# EAGLE design Sensor Acquisition Board Front rev1 (EAGLE 9.6.2)
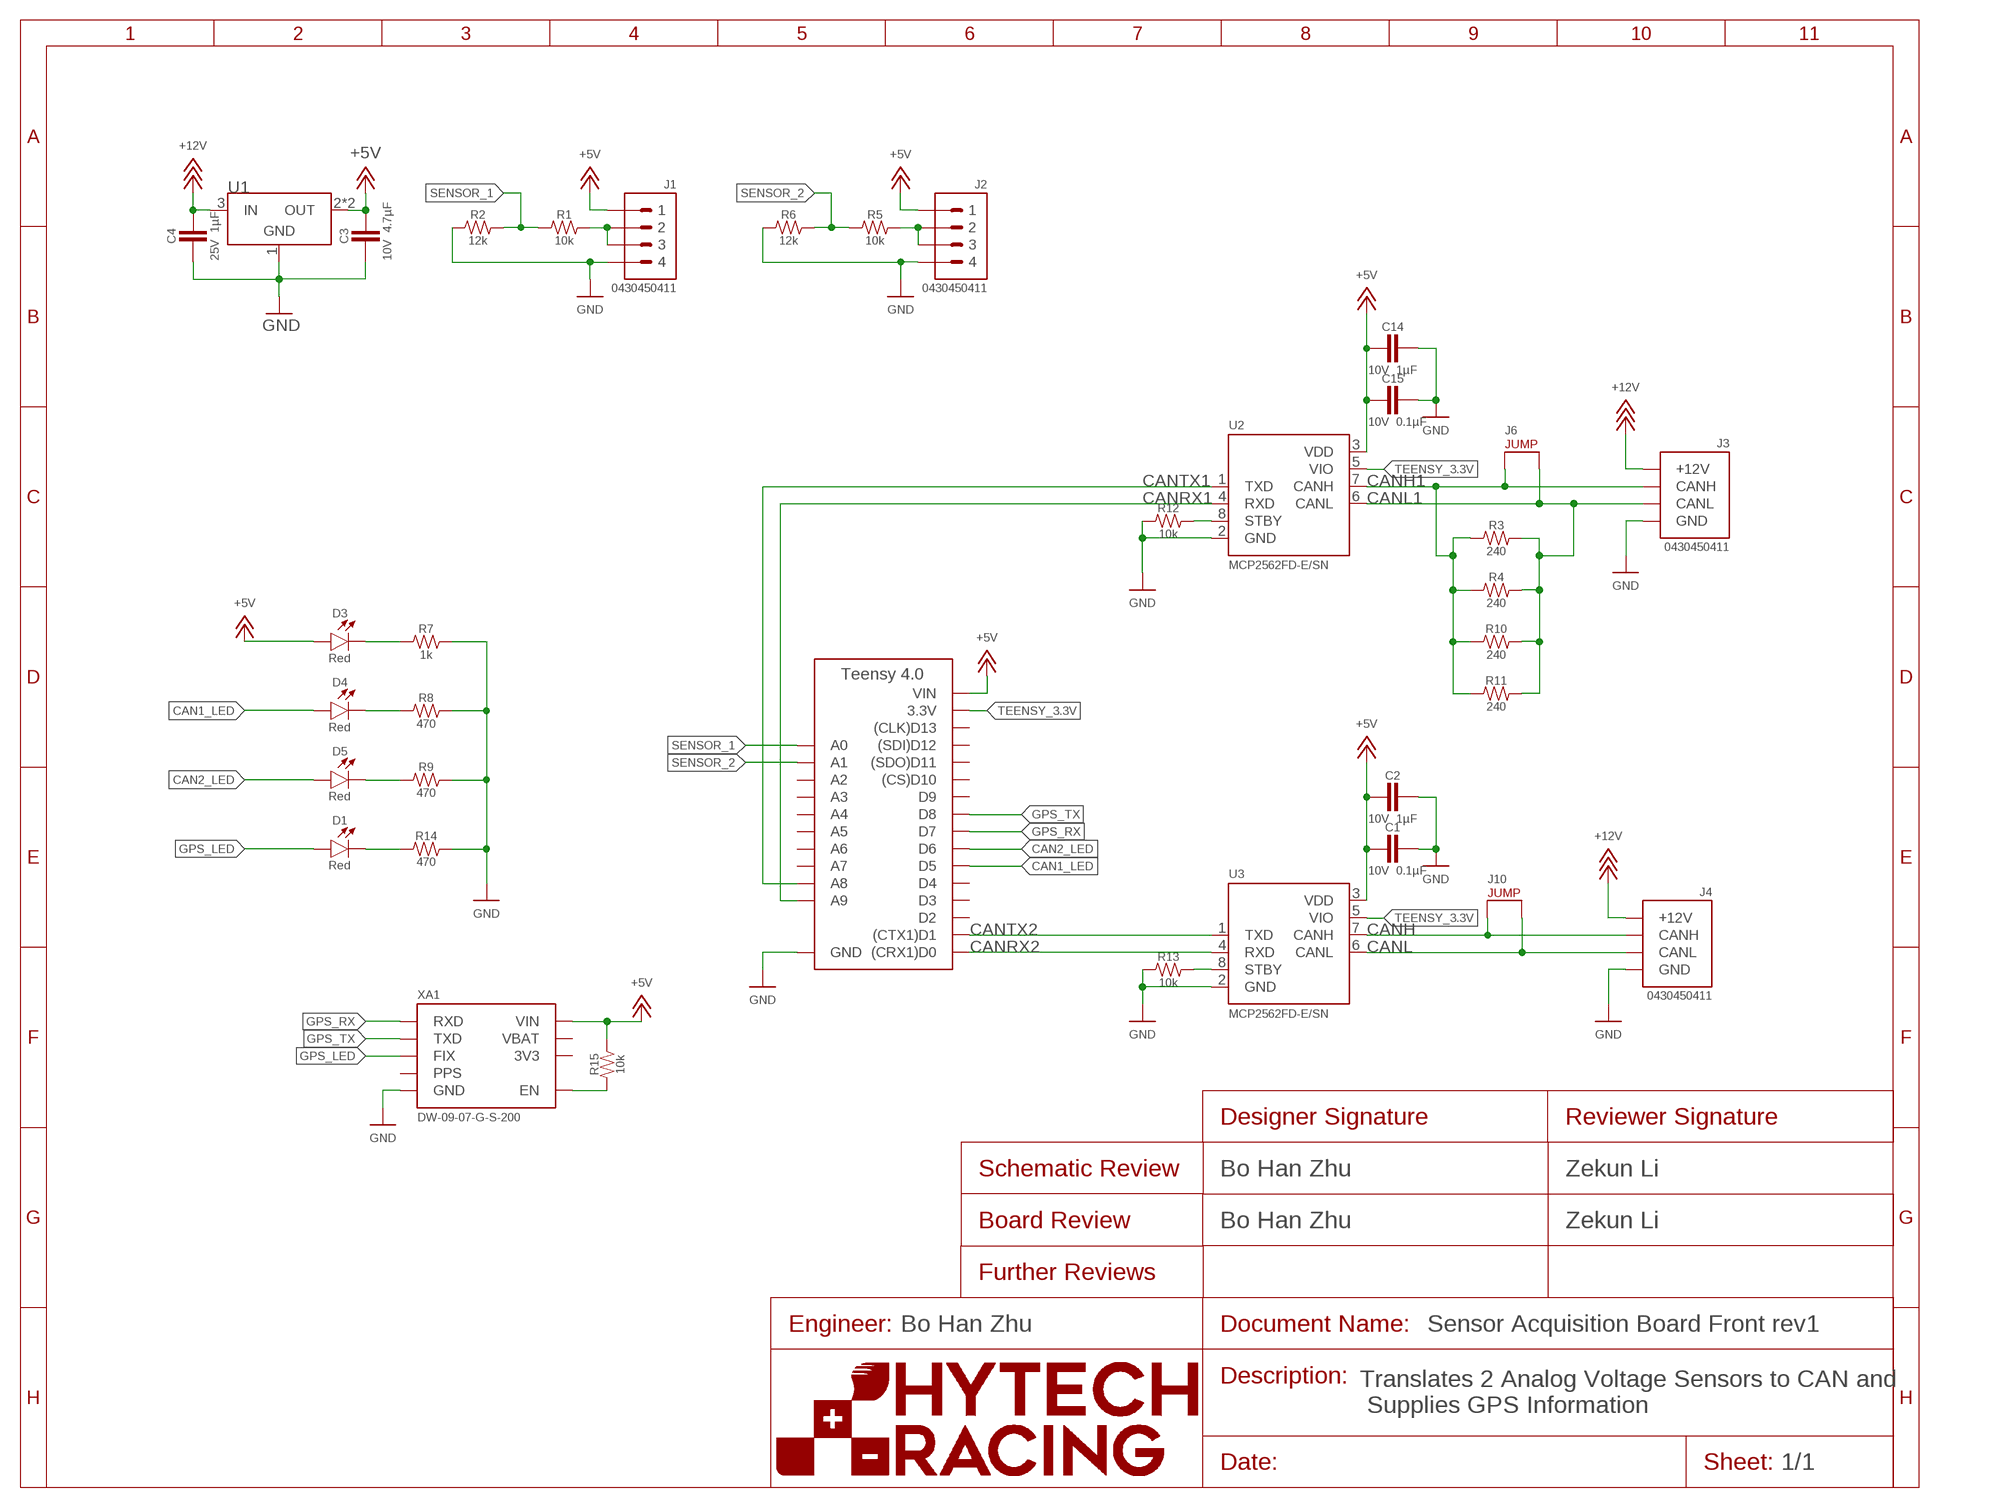
[diagram p0: schematic, sheet 1]
FRAME1 (FRAME): DESCRIPTION_1: Translates 8 Analog Voltage Sensors to CAN; DESIGNER_BOARD: Bo Han Zhu; DESIGNER_SCHEMATIC: Bo Han Zhu; ENGINEER: Bo Han Zhu; REVIEWER_BOARD: Zekun Li; REVIEWER_SCHEMATIC: Zekun Li

## Parts
A2  TEENSY_4.0  [TEENSY_SHORT]
C1  CAPACITOR_0603_10V_0.1UF  [0603-CAP]
C2  CAPACITOR_0603_10V_1UF  [0603-CAP]
C3  CAPACITOR_0603_10V_4.7UF  [0603-CAP]
C4  CAPACITOR_0603_25V_1UF  [0603-CAP]
C14  CAPACITOR_0603_10V_1UF  [0603-CAP]
C15  CAPACITOR_0603_10V_0.1UF  [0603-CAP]
D1  LED_0603_RED  [0603-LED]
D3  LED_0603_RED  [0603-LED]
D4  LED_0603_RED  [0603-LED]
D5  LED_0603_RED  [0603-LED]
J1  CONNECTOR-4_μF_S_RA_  [MOLEX_MICROFIT_SMD_RIGHTANGLE_04_DUAL]
J2  CONNECTOR-4_μF_S_RA_  [MOLEX_MICROFIT_SMD_RIGHTANGLE_04_DUAL]
J3  CONNECTOR-CAN_μF_S_RA_  [MOLEX_MICROFIT_SMD_RIGHTANGLE_04_DUAL]
J4  CONNECTOR-CAN_μF_S_RA_  [MOLEX_MICROFIT_SMD_RIGHTANGLE_04_DUAL]
J6  JUMPER_0603_  [0603-RES]
J10  JUMPER_0603_  [0603-RES]
R1  RESISTOR_0603_10K  [0603-RES]
R2  RESISTOR_0603_12K  [0603-RES]
R3  RESISTOR_0603_240  [0603-RES]
R4  RESISTOR_0603_240  [0603-RES]
R5  RESISTOR_0603_10K  [0603-RES]
R6  RESISTOR_0603_12K  [0603-RES]
R7  RESISTOR_0603_1K  [0603-RES]
R8  RESISTOR_0603_470  [0603-RES]
R9  RESISTOR_0603_470  [0603-RES]
R10  RESISTOR_0603_240  [0603-RES]
R11  RESISTOR_0603_240  [0603-RES]
R12  RESISTOR_0603_10K  [0603-RES]
R13  RESISTOR_0603_10K  [0603-RES]
R14  RESISTOR_0603_470  [0603-RES]
R15  RESISTOR_0603_10K  [0603-RES]
U1  VOLTAGE_REGULATOR_SOT-223_5V  [SOT-223]
U2  MCP2562FD  [SOIC-08(NARROW,0.15")]
U3  MCP2562FD  [SOIC-08(NARROW,0.15")]
XA1  ULTIMATE_GPS  [ULTIMATE_GPS]

## Nets
+5V: A2.VIN C1.2 C2.2 C3.1 C14.2 C15.2 D3.2(A) J1.1 J2.1 R15.2 U1.2(OUT) U1.4(OUT) U2.3(VDD) U3.3(VDD) XA1.VIN
+12V: C4.1 J3.1(+12V) J4.1(+12V) U1.3(IN)
CAN1_LED: A2.D5 D4.2(A)
CAN2_LED: A2.D6 D5.2(A)
CANH: J4.4(CANH) J10.1 U3.7(CANH)
CANH1: J3.4(CANH) J6.1 R3.1 R4.1 R10.1 R11.1 U2.7(CANH)
CANL: J4.3(CANL) J10.2 U3.6(CANL)
CANL1: J3.3(CANL) J6.2 R3.2 R4.2 R10.2 R11.2 U2.6(CANL)
CANRX1: A2.D23(A9) U2.4(RXD)
CANRX2: A2.D0((CRX1)D0) U3.4(RXD)
CANTX1: A2.D22(A8) U2.1(TXD)
CANTX2: A2.D1((CTX1)D1) U3.1(TXD)
GND: A2.AGND/GND(GND) A2.GND C1.1 C2.1 C3.2 C4.2 C14.1 C15.1 J1.4 J2.4 J3.2(GND) J4.2(GND) R2.1 R6.1 R7.2 R8.2 R9.2 R12.1 R13.1 R14.2 U1.1(GND) U2.2(GND) U3.2(GND) XA1.GND
GPS_LED: D1.2(A) XA1.FIX
GPS_RX: A2.D7 XA1.RX(RXD)
GPS_TX: A2.D8 XA1.TX(TXD)
N$1: R12.2 U2.8(STBY)
N$2: R13.2 U3.8(STBY)
N$3: D3.1(C) R7.1
N$4: D1.1(C) R14.1
N$5: D4.1(C) R8.1
N$6: D5.1(C) R9.1
N$7: R15.1 XA1.EN
N$8: J1.2 J1.3 R1.2
N$11: J2.2 J2.3 R5.2
SENSOR_1: A2.D14(A0) R1.1 R2.2
SENSOR_2: A2.D15(A1) R5.1 R6.2
TEENSY_3.3V: A2.3.3V U2.5(VIO) U3.5(VIO)
Unconnected: A2.D2 A2.D3 A2.D4 A2.D9 A2.D10((CS)D10) A2.D11((SDO)D11) A2.D12((SDI)D12) A2.D13((CLK)D13) A2.D16(A2) A2.D17(A3) A2.D18(A4) A2.D19(A5) A2.D20(A6) A2.D21(A7) XA1.PPS

## Notes on the sheet
- Translates 2 Analog Voltage Sensors to CAN and
   Supplies GPS Information

## Power pins joined to a net without a drawn wire
3V3: XA1.3.3V(3V3)
VBAT: XA1.VBAT

## Library data of the parts
A2 = HyTechDevices:TEENSY_4.0: Teensy 4.0 Datasheet <https://www.pjrc.com/store/teensy40.html> Requires ordering of: 2: 14 pin, 0.1" pitch female headers; TEENSY: 4.0
C1 C15 = HyTechDevices:CAPACITOR_?_*: Capacitor, Non-Polarized VJ...1BC Series Datasheet <https://www.mouser.com/datasheet/2/427/vjw1bcbascomseries-1762447.pdf> Samsung Datasheet <https://www.mouser.com/datasheet/2/585/MLCC-1837944.pdf> Walsin Datasheet <https://www.mouser.com/datasheet/2/210/WTC_MLCC_General_Purpose-1534899.pdf> GRM188R61A226ME15D <https://www.mouser.com/datasheet/2/281/1/GRM188R61A226ME15_02A-1985787.pdf> GRM188R61E106MA73D <https://www.mouser.com/datasheet/2/281/1/GRM188R61E106MA73_01A-1985806.pdf> 885012006013 <https://www.mouser.com/datasheet/2/445/885012006013-1726946.pdf> 2220Y6300105KXTWS2 <https://www.mouser.com/datasheet/2/218/SMD_High_and_Std_StackiCap_P62-1825512.pdf> Yageo Class 2, X5R <https://www.mouser.com/datasheet/2/447/UPY_GPHC_X5R_4V_to_50V_26-1827097.pdf> TDK C Series <https://www.mouser.com/ProductDetail/TDK/C3216X5R1V226M160AC?qs=%2Fha2pyFadujbcx9jh7lYl%2F4NeMoXFhdc8AqVWNq4wW6M2y7zl6GzBuhgtI0ngznN> AVX Automotive MLCC <https://www.mouser.com/datasheet/2/40/AutoMLCC-777028.pdf> KEMET X7R Series <https://www.mouser.com/datasheet/2/212/KEM_C1002_X7R_SMD-1102033.pdf> Kyocera AVX <https://www.mouser.com/datasheet/2/40/C0GNP0_Dielectric-951274.pdf>; CAPACITANCE: 0.1µF; DKPN: 720-1688-1-ND; MANUFACTURER: Vishay Vitramon; MOPN: 77-VJ0603Y104JXQPBC; MPN: VJ0603Y104JXQPW1BC; TOLERANCE: 5%; VOLTAGE: 10V
C2 C14 = HyTechDevices:CAPACITOR_?_*: Capacitor, Non-Polarized VJ...1BC Series Datasheet <https://www.mouser.com/datasheet/2/427/vjw1bcbascomseries-1762447.pdf> Samsung Datasheet <https://www.mouser.com/datasheet/2/585/MLCC-1837944.pdf> Walsin Datasheet <https://www.mouser.com/datasheet/2/210/WTC_MLCC_General_Purpose-1534899.pdf> GRM188R61A226ME15D <https://www.mouser.com/datasheet/2/281/1/GRM188R61A226ME15_02A-1985787.pdf> GRM188R61E106MA73D <https://www.mouser.com/datasheet/2/281/1/GRM188R61E106MA73_01A-1985806.pdf> 885012006013 <https://www.mouser.com/datasheet/2/445/885012006013-1726946.pdf> 2220Y6300105KXTWS2 <https://www.mouser.com/datasheet/2/218/SMD_High_and_Std_StackiCap_P62-1825512.pdf> Yageo Class 2, X5R <https://www.mouser.com/datasheet/2/447/UPY_GPHC_X5R_4V_to_50V_26-1827097.pdf> TDK C Series <https://www.mouser.com/ProductDetail/TDK/C3216X5R1V226M160AC?qs=%2Fha2pyFadujbcx9jh7lYl%2F4NeMoXFhdc8AqVWNq4wW6M2y7zl6GzBuhgtI0ngznN> AVX Automotive MLCC <https://www.mouser.com/datasheet/2/40/AutoMLCC-777028.pdf> KEMET X7R Series <https://www.mouser.com/datasheet/2/212/KEM_C1002_X7R_SMD-1102033.pdf> Kyocera AVX <https://www.mouser.com/datasheet/2/40/C0GNP0_Dielectric-951274.pdf>; CAPACITANCE: 1µF; DKPN: 311-1796-1-ND; MANUFACTURER: Yageo; MOPN: 603-CC603KRX7R6BB105; MPN: CC0603KRX7R6BB105; TOLERANCE: 10%; VOLTAGE: 10V
C3 = HyTechDevices:CAPACITOR_?_*: Capacitor, Non-Polarized VJ...1BC Series Datasheet <https://www.mouser.com/datasheet/2/427/vjw1bcbascomseries-1762447.pdf> Samsung Datasheet <https://www.mouser.com/datasheet/2/585/MLCC-1837944.pdf> Walsin Datasheet <https://www.mouser.com/datasheet/2/210/WTC_MLCC_General_Purpose-1534899.pdf> GRM188R61A226ME15D <https://www.mouser.com/datasheet/2/281/1/GRM188R61A226ME15_02A-1985787.pdf> GRM188R61E106MA73D <https://www.mouser.com/datasheet/2/281/1/GRM188R61E106MA73_01A-1985806.pdf> 885012006013 <https://www.mouser.com/datasheet/2/445/885012006013-1726946.pdf> 2220Y6300105KXTWS2 <https://www.mouser.com/datasheet/2/218/SMD_High_and_Std_StackiCap_P62-1825512.pdf> Yageo Class 2, X5R <https://www.mouser.com/datasheet/2/447/UPY_GPHC_X5R_4V_to_50V_26-1827097.pdf> TDK C Series <https://www.mouser.com/ProductDetail/TDK/C3216X5R1V226M160AC?qs=%2Fha2pyFadujbcx9jh7lYl%2F4NeMoXFhdc8AqVWNq4wW6M2y7zl6GzBuhgtI0ngznN> AVX Automotive MLCC <https://www.mouser.com/datasheet/2/40/AutoMLCC-777028.pdf> KEMET X7R Series <https://www.mouser.com/datasheet/2/212/KEM_C1002_X7R_SMD-1102033.pdf> Kyocera AVX <https://www.mouser.com/datasheet/2/40/C0GNP0_Dielectric-951274.pdf>; CAPACITANCE: 4.7µF; DKPN: 1276-1044-1-ND; MANUFACTURER: Samsung Electro-Mechanics; MOPN: 187-CL10A475KP8NNNC; MPN: CL10A475KP8NNNC; TOLERANCE: 10%; VOLTAGE: 10V
C4 = HyTechDevices:CAPACITOR_?_*: Capacitor, Non-Polarized VJ...1BC Series Datasheet <https://www.mouser.com/datasheet/2/427/vjw1bcbascomseries-1762447.pdf> Samsung Datasheet <https://www.mouser.com/datasheet/2/585/MLCC-1837944.pdf> Walsin Datasheet <https://www.mouser.com/datasheet/2/210/WTC_MLCC_General_Purpose-1534899.pdf> GRM188R61A226ME15D <https://www.mouser.com/datasheet/2/281/1/GRM188R61A226ME15_02A-1985787.pdf> GRM188R61E106MA73D <https://www.mouser.com/datasheet/2/281/1/GRM188R61E106MA73_01A-1985806.pdf> 885012006013 <https://www.mouser.com/datasheet/2/445/885012006013-1726946.pdf> 2220Y6300105KXTWS2 <https://www.mouser.com/datasheet/2/218/SMD_High_and_Std_StackiCap_P62-1825512.pdf> Yageo Class 2, X5R <https://www.mouser.com/datasheet/2/447/UPY_GPHC_X5R_4V_to_50V_26-1827097.pdf> TDK C Series <https://www.mouser.com/ProductDetail/TDK/C3216X5R1V226M160AC?qs=%2Fha2pyFadujbcx9jh7lYl%2F4NeMoXFhdc8AqVWNq4wW6M2y7zl6GzBuhgtI0ngznN> AVX Automotive MLCC <https://www.mouser.com/datasheet/2/40/AutoMLCC-777028.pdf> KEMET X7R Series <https://www.mouser.com/datasheet/2/212/KEM_C1002_X7R_SMD-1102033.pdf> Kyocera AVX <https://www.mouser.com/datasheet/2/40/C0GNP0_Dielectric-951274.pdf>; CAPACITANCE: 1µF; DKPN: 1276-1184-1-ND; MANUFACTURER: Samsung Electro-Mechanics; MOPN: 187-CL10B105KA8NNNC; MPN: CL10B105KA8NNNC; TOLERANCE: 10%; VOLTAGE: 25V
D1 D3-D5 = HyTechDevices:LED_?_*: LED 0603 Blue <https://www.mouser.com/datasheet/2/216/APT1608VBC_D-246010.pdf> Green <https://www.mouser.com/datasheet/2/216/APT1608ZGCK-1173388.pdf> Orange <https://www.mouser.com/datasheet/2/216/APT1608SECK-6197.pdf> Red <https://www.mouser.com/datasheet/2/216/APT1608SECK-J3-PRV-1173336.pdf> White <https://www.mouser.com/datasheet/2/50/SM0603UWC-880813.pdf> Yellow <https://www.mouser.com/datasheet/2/216/APT1608SYCK-J3-PRV-1173311.pdf> 2835 (Series not on Digikey) Lumiled LUXEON 2835 Color Line <https://www.mouser.com/datasheet/2/602/DS236_luxeon_2835_color_line_datasheet-1596094.pdf>; COLOR: Red; DKPN: 754-1786-1-ND; MANUFACTURER: Kingbright; MOPN: 604-APT1608SECKJ3PRV; MPN: APT1608SECK/J3-PRV
J1 J2 = HyTechDevices:CONNECTOR-4_?_*; DKPN: WM1832CT-ND; MANUFACTURER: Molex; MOPN: 538-0430450411; MPN: 0430450411
J3 J4 = HyTechDevices:CONNECTOR-CAN_?_*: HyTech CAN Connector; DKPN: WM1832CT-ND; MANUFACTURER: Molex; MOPN: 538-43045-0411; MPN: 0430450411
J6 J10 = HyTechDevices:JUMPER_?_*: 2 Pin Connector; DKPN: 13-RC0603FR-130RLTR-ND; MANUFACTURER: YAGEO; MOPN: 603-RC0603FR-130RL; MPN: RC0603FR-130RL
R1 R5 R12 R13 R15 = HyTechDevices:RESISTOR_?_*: Resistor PWR163 Series <https://www.mouser.com/datasheet/2/54/pwr163-777985.pdf> AC Series <https://www.mouser.com/datasheet/2/447/Yageo_PYu_AC_51_RoHS_L_7_1714230-1874691.pdf> PU Series <https://www.mouser.com/datasheet/2/447/PYu-PU_51_RoHS_L_6-1504619.pdf> ERA Series <https://www.mouser.com/datasheet/2/315/AOA0000C307-1149632.pdf> PWR263 Series <https://www.mouser.com/datasheet/2/54/pwr263s_35-778069.pdf> RC Series <https://www.mouser.com/datasheet/2/447/Yageo_03_18_2021_PYu_RC_Group_51_RoHS_L_11-2199992.pdf> ERJ PB3, PB6 Series <https://www.mouser.com/datasheet/2/315/AOA0000C328-1530132.pdf> ERJ PA2, P03, PA3, P06, P08, P14 Series <https://www.mouser.com/datasheet/2/315/AOA0000C331-1141874.pdf>; DKPN: 311-10.0KHRCT-ND; MANUFACTURER: Yageo; MOPN: 603-RC0603FR-0710KL; MPN: RC0603FR-0710KL; POWER: 0.1W; RESISTANCE: 10k; TOLERANCE: 1%; VOLTAGE_CONTINUOUS: 31.62V; VOLTAGE_MAX: 75V
R2 R6 = HyTechDevices:RESISTOR_?_*: Resistor PWR163 Series <https://www.mouser.com/datasheet/2/54/pwr163-777985.pdf> AC Series <https://www.mouser.com/datasheet/2/447/Yageo_PYu_AC_51_RoHS_L_7_1714230-1874691.pdf> PU Series <https://www.mouser.com/datasheet/2/447/PYu-PU_51_RoHS_L_6-1504619.pdf> ERA Series <https://www.mouser.com/datasheet/2/315/AOA0000C307-1149632.pdf> PWR263 Series <https://www.mouser.com/datasheet/2/54/pwr263s_35-778069.pdf> RC Series <https://www.mouser.com/datasheet/2/447/Yageo_03_18_2021_PYu_RC_Group_51_RoHS_L_11-2199992.pdf> ERJ PB3, PB6 Series <https://www.mouser.com/datasheet/2/315/AOA0000C328-1530132.pdf> ERJ PA2, P03, PA3, P06, P08, P14 Series <https://www.mouser.com/datasheet/2/315/AOA0000C331-1141874.pdf>; DKPN: 311-12.0KHRCT-ND; MANUFACTURER: Yageo; MOPN: 603-RC0603FR-0712KL; MPN: RC0603FR-0712KL; POWER: 0.1W; RESISTANCE: 12k; TOLERANCE: 1%; VOLTAGE_CONTINUOUS: 34.64V; VOLTAGE_MAX: 75V
R3 R4 R10 R11 = HyTechDevices:RESISTOR_?_*: Resistor PWR163 Series <https://www.mouser.com/datasheet/2/54/pwr163-777985.pdf> AC Series <https://www.mouser.com/datasheet/2/447/Yageo_PYu_AC_51_RoHS_L_7_1714230-1874691.pdf> PU Series <https://www.mouser.com/datasheet/2/447/PYu-PU_51_RoHS_L_6-1504619.pdf> ERA Series <https://www.mouser.com/datasheet/2/315/AOA0000C307-1149632.pdf> PWR263 Series <https://www.mouser.com/datasheet/2/54/pwr263s_35-778069.pdf> RC Series <https://www.mouser.com/datasheet/2/447/Yageo_03_18_2021_PYu_RC_Group_51_RoHS_L_11-2199992.pdf> ERJ PB3, PB6 Series <https://www.mouser.com/datasheet/2/315/AOA0000C328-1530132.pdf> ERJ PA2, P03, PA3, P06, P08, P14 Series <https://www.mouser.com/datasheet/2/315/AOA0000C331-1141874.pdf>; DKPN: 311-240HRCT-ND; MANUFACTURER: Yageo; MOPN: 603-RC0603FR-07240RL; MPN: RC0603FR-07240RL; POWER: 0.1W; RESISTANCE: 240; TOLERANCE: 1%; VOLTAGE_CONTINUOUS: 4.90V; VOLTAGE_MAX: 75V
R7 = HyTechDevices:RESISTOR_?_*: Resistor PWR163 Series <https://www.mouser.com/datasheet/2/54/pwr163-777985.pdf> AC Series <https://www.mouser.com/datasheet/2/447/Yageo_PYu_AC_51_RoHS_L_7_1714230-1874691.pdf> PU Series <https://www.mouser.com/datasheet/2/447/PYu-PU_51_RoHS_L_6-1504619.pdf> ERA Series <https://www.mouser.com/datasheet/2/315/AOA0000C307-1149632.pdf> PWR263 Series <https://www.mouser.com/datasheet/2/54/pwr263s_35-778069.pdf> RC Series <https://www.mouser.com/datasheet/2/447/Yageo_03_18_2021_PYu_RC_Group_51_RoHS_L_11-2199992.pdf> ERJ PB3, PB6 Series <https://www.mouser.com/datasheet/2/315/AOA0000C328-1530132.pdf> ERJ PA2, P03, PA3, P06, P08, P14 Series <https://www.mouser.com/datasheet/2/315/AOA0000C331-1141874.pdf>; DKPN: 311-1.00KHRCT-ND; MANUFACTURER: Yageo; MOPN: 603-RC0603FR-071KL; MPN: RC0603FR-071KL; POWER: 0.1W; RESISTANCE: 1k; TOLERANCE: 1%; VOLTAGE_CONTINUOUS: 10.00V; VOLTAGE_MAX: 75V
R8 R9 R14 = HyTechDevices:RESISTOR_?_*: Resistor PWR163 Series <https://www.mouser.com/datasheet/2/54/pwr163-777985.pdf> AC Series <https://www.mouser.com/datasheet/2/447/Yageo_PYu_AC_51_RoHS_L_7_1714230-1874691.pdf> PU Series <https://www.mouser.com/datasheet/2/447/PYu-PU_51_RoHS_L_6-1504619.pdf> ERA Series <https://www.mouser.com/datasheet/2/315/AOA0000C307-1149632.pdf> PWR263 Series <https://www.mouser.com/datasheet/2/54/pwr263s_35-778069.pdf> RC Series <https://www.mouser.com/datasheet/2/447/Yageo_03_18_2021_PYu_RC_Group_51_RoHS_L_11-2199992.pdf> ERJ PB3, PB6 Series <https://www.mouser.com/datasheet/2/315/AOA0000C328-1530132.pdf> ERJ PA2, P03, PA3, P06, P08, P14 Series <https://www.mouser.com/datasheet/2/315/AOA0000C331-1141874.pdf>; DKPN: P470BYCT-ND; MANUFACTURER: Panasonic Electronic Components; MOPN: 667-ERJ-PA3F4700V; MPN: ERJ-PA3F4700V; POWER: 0.25W; RESISTANCE: 470; TOLERANCE: 1%; VOLTAGE_CONTINUOUS: 10.84V; VOLTAGE_MAX: 150V
U1 = HyTechDevices:VOLTAGE_REGULATOR_?_*: Voltage Regulators LDL1117S50R Datasheet <https://www.mouser.com/datasheet/2/389/dm00366442-1799212.pdf> NCP785AH120T1G <https://www.mouser.com/datasheet/2/308/NCP785A_D-1812704.pdf> LMS8117A Datasheet <https://www.ti.com/lit/ds/symlink/lms8117a.pdf?HQS>; DKPN: 497-17240-1-ND; MANUFACTURER: STMicroelectronics; MOPN: 511-LDL1117S50R; MPN: LDL1117S50R
U2 U3 = HyTechDevices:MCP2562FD: MCP2562FD Can Tranciever Datasheet <https://ww1.microchip.com/downloads/en/DeviceDoc/20005284A.pdf>; ALT_DKPN: MCP2562-E/SN-ND; ALT_MANUFACTURER: Microchip Technology; ALT_MOPN: 579-MCP2562-E/SN; ALT_MPN: MCP2562-E/SN; DKPN: MCP2562FD-E/SN-ND; MANUFACTURER: Microchip Technology; MOPN: 579-MCP2562FD-E/SN; MPN: MCP2562FD-E/SN
XA1 = HyTechDevices:ULTIMATE_GPS: Adafruit Ultimate GPS Breakout - 66 channel w/10 Hz updates - Version 3 Datasheet <https://www.mouser.com/datasheet/2/737/adafruit_ultimate_gps-779243.pdf> Requires ordering of: 2: 5mm height, 3mm screw standoffs 1: Ultimate GPS 1: Antenna; DKPN: DW-09-07-G-S-200-ND; MANUFACTURER: Samtec Inc.; MOPN: 200-DW0907GS200; MPN: DW-09-07-G-S-200

## Board
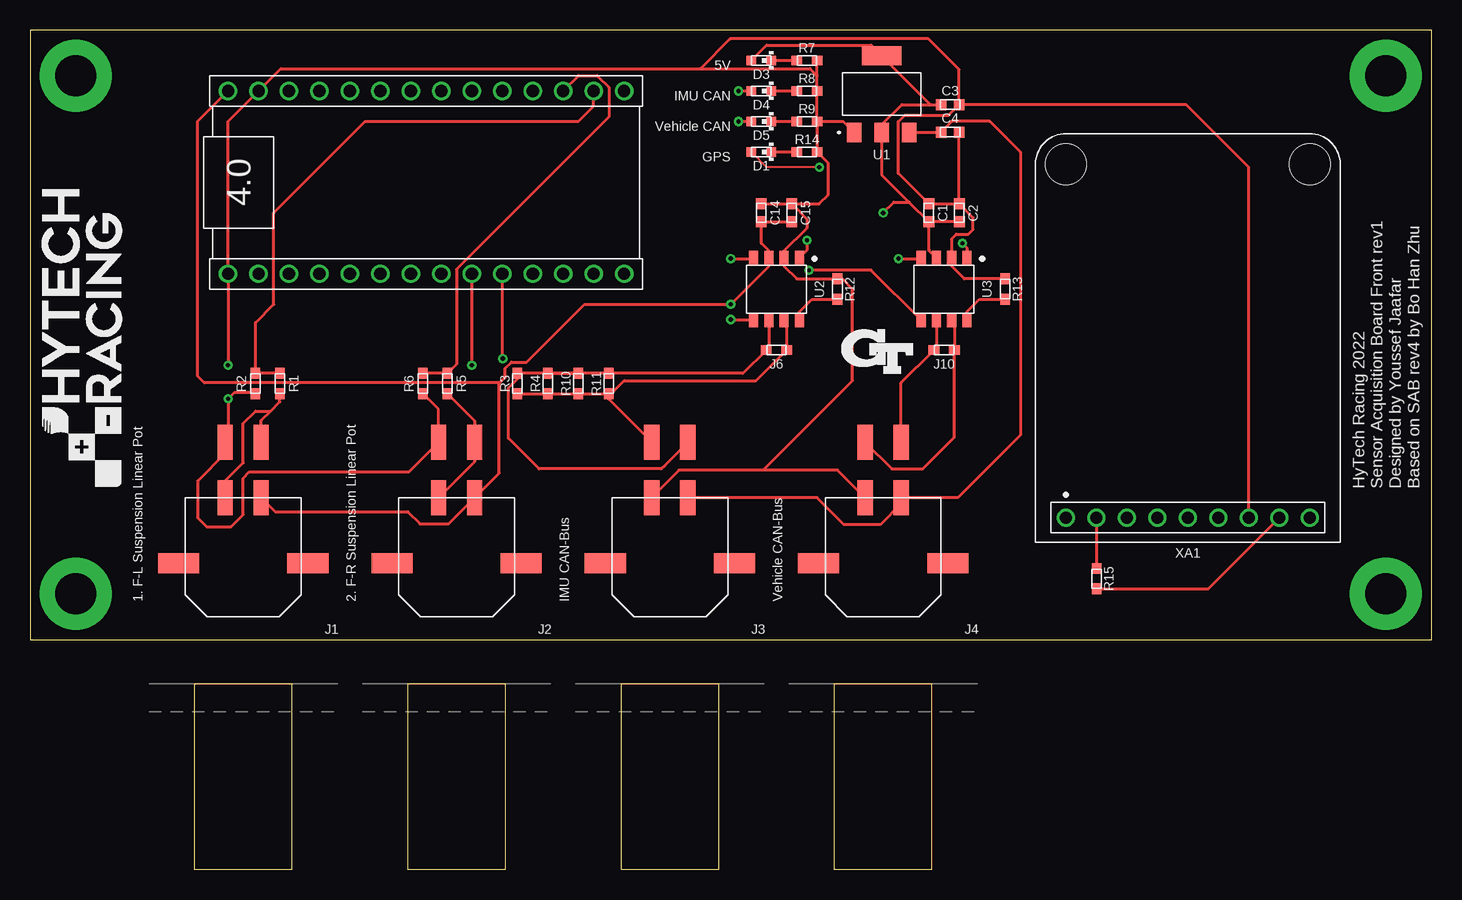
[diagram p1: board, top side]
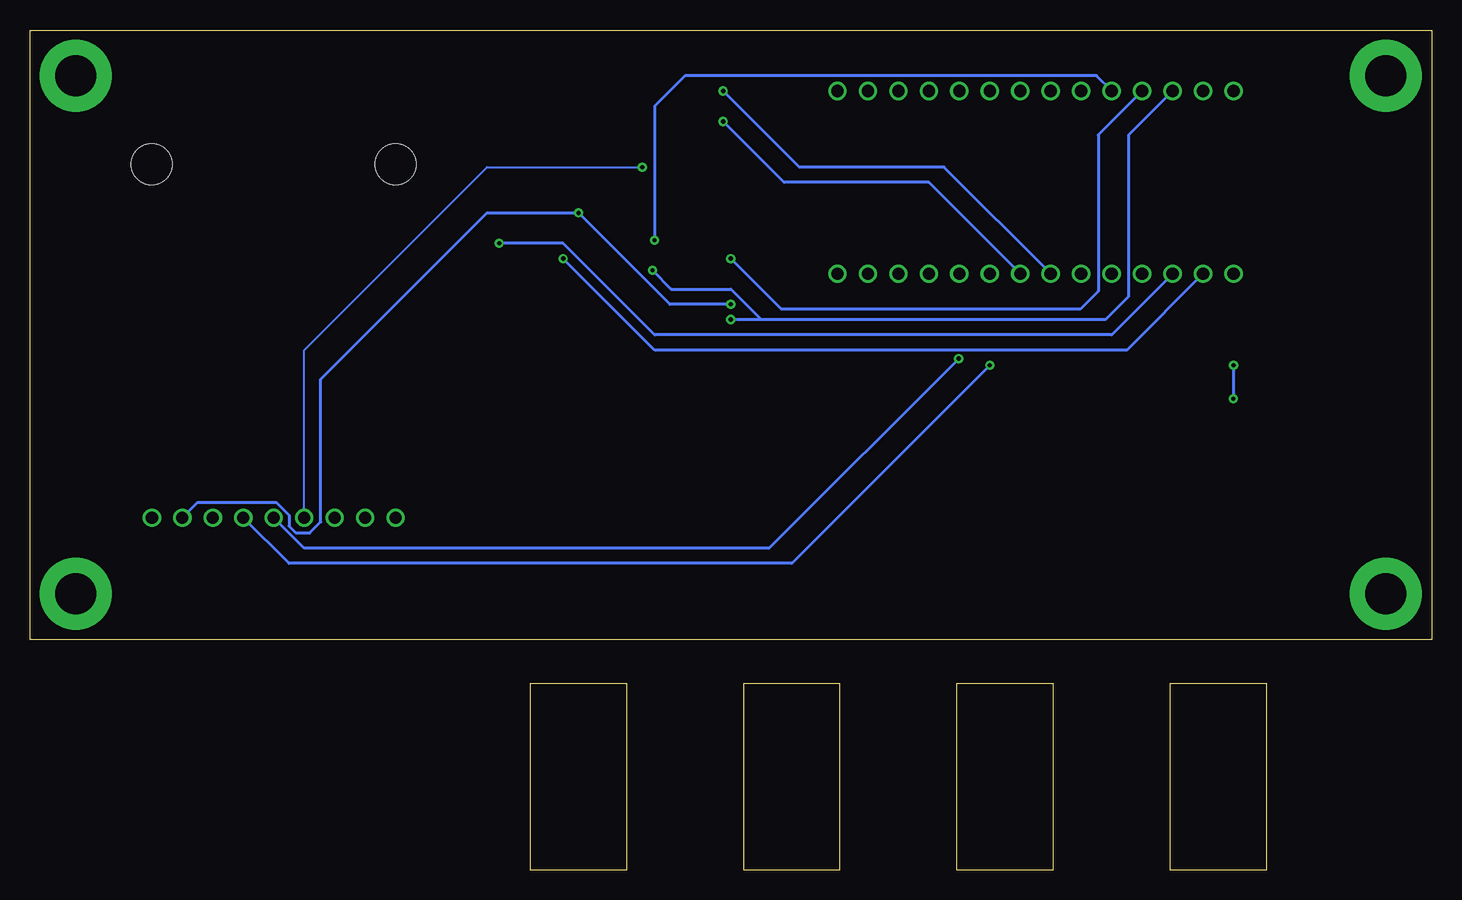
[diagram p2: board, bottom side, seen from below]

Size 116.84 x 50.8 mm. Coordinates in mm from the lower left corner, seen from the top.
Outline: 0,0 116.84,0 116.84,50.8 0,50.8 0,0
Copper layers (1*16): Top 0.035mm / dielectric 1.53mm / Bottom 0.035mm
Design rules "HyTech Default (2 Layer)": minimum track width 6mil, minimum drill 14mil, track to track 6mil, track to pad 6mil, pad to pad 6mil, via to via 20mil, smd to smd 6mil, copper to edge 20mil, drill to drill 21mil, minimum pad ring 7mil, minimum via ring 8mil, stop-mask expansion 6mil, vias tented up to drill 30mil, thermal gap 10mil

### Footprints (pad centres in the part's own frame; a part is rotated, then mirrored left to right if it is on the bottom)
TEENSY_SHORT = drill 1.016: 3.3V 0,5.08; AGND/GND 0,2.54; D0 15.24,2.54; D1 15.24,5.08; D2 15.24,7.62; D3 15.24,10.16; D4 15.24,12.7; D5 15.24,15.24; D6 15.24,17.78; D7 15.24,20.32; D8 15.24,22.86; D9 15.24,25.4; D10 15.24,27.94; D11 15.24,30.48; D12 15.24,33.02; D13 0,33.02; D14 0,30.48; D15 0,27.94; D16 0,25.4; D17 0,22.86; D18 0,20.32; D19 0,17.78; D20 0,15.24; D21 0,12.7; D22 0,10.16; D23 0,7.62; GND 15.24,0; VIN 0,0
0603-CAP = smd 0.9 x 0.9: 1 -0.75,0; 2 0.75,0
0603-LED = smd 0.8 x 0.8: 1 -0.825,0; 2 0.825,0
MOLEX_MICROFIT_SMD_RIGHTANGLE_04_DUAL = smd 1.27 x 2.921: 1 1.5,5.474; 2 -1.5,5.474; 3 1.5,10.097; 4 -1.5,10.097 | smd 3.429 x 1.651: PAD1 5.386,0; PAD2 -5.386,0
0603-RES = smd 0.9 x 0.8: 1 -0.85,0; 2 0.85,0
SOT-223 = smd 1.2 x 1.6: 1 -2.3,-3.2; 2 0,-3.2; 3 2.3,-3.2 | smd 3.3 x 1.6: 4 0,3.2
SOIC-08(NARROW,0.15") = smd 0.762 x 1.143: 1 -1.905,-2.603; 2 -0.635,-2.603; 3 0.635,-2.603; 4 1.905,-2.603; 5 1.905,2.603; 6 0.635,2.603; 7 -0.635,2.603; 8 -1.905,2.603
MOUNTING_M3 = drill 3.4 pad 6: 1 0,0
ULTIMATE_GPS = drill 1.016: 3.3V -10.16,0; EN -7.62,0; FIX -2.54,0; GND 5.08,0; PPS 10.16,0; RX 2.54,0; TX 0,0; VBAT -5.08,0; VIN 7.62,0 | hole 3.4: -10.16,29.464; 10.16,29.464

### Placement (x,y rotation side)
A2  16.51,45.72 270 top
C1  74.93,35.56 270 top
C2  77.47,35.56 270 top
C3  76.71,44.58 0 top
C4  76.71,42.29 0 top
C14  60.96,35.56 270 top
C15  63.5,35.56 270 top
D1  60.96,40.64 180 top
D3  60.96,48.26 180 top
D4  60.96,45.72 180 top
D5  60.96,43.18 180 top
J1  17.78,6.35 0 top
J2  35.56,6.35 0 top
J3  53.34,6.35 0 top
J4  71.12,6.35 0 top
J6  62.23,24.13 180 top
J10  76.2,24.13 180 top
R1  20.83,21.34 270 top
R2  18.8,21.34 90 top
R3  40.64,21.34 90 top
R4  43.18,21.34 90 top
R5  34.8,21.34 270 top
R6  32.77,21.34 90 top
R7  64.77,48.26 0 top
R8  64.77,45.72 0 top
R9  64.77,43.18 0 top
R10  45.72,21.34 90 top
R11  48.26,21.34 90 top
R12  67.31,29.21 270 top
R13  81.28,29.21 270 top
R14  64.77,40.64 0 top
R15  88.9,5.08 270 top
U1  70.99,45.47 0 top
U2  62.23,29.21 180 top
U3  76.2,29.21 180 top
U$1  [MOUNTING_M3]  113.03,3.81 0 top
U$2  [MOUNTING_M3]  3.81,3.81 0 top
U$4  [MOUNTING_M3]  113.03,46.99 0 top
U$5  [MOUNTING_M3]  3.81,46.99 0 top
U$6  [LOGO_GT_0.25"]  70.61,24 0 top
U$7  [LOGO_HYTECH_MEDIUM]  7.62,12.7 90 top
XA1  96.52,10.16 0 top

### Tracks (layer width: path | path; a pad name or v marks a point on that pad's centre or on a via)
+5V  (via drill 0.36)
  Top 0.254: A2.VIN 13.97,43.18 13.97,21.95 | C15.2 C14.2 60.96,33.02 61.59,32.38 U2.3 61.59,31.11 v58.42,27.94 46.23,27.94 41.4,23.11 40.13,23.11 39.62,22.61 39.62,21.84 39.16,21.39 39.12,21.39 | D3.2 61.41,49.53 70.13,49.53 U1.4 75.08,44.58 | 75.08,44.58 72.67,44.58 70.99,42.9 U1.2 70.99,38.75 73.28,36.45 | 75.08,44.58 C3.1 | C2.2 C1.2 | 73.28,36.45 C1.2 | U3.3 74.95,32.42 74.95,32.5 74.93,32.53 C1.2 | v71.12,35.56 72.02,36.45 73.28,36.45 | R15.2 98.21,4.23 XA1.VIN | 13.97,21.95 14.54,21.39 39.12,21.39 | 13.97,21.95 | J1.1 20.44,10.67 31.5,10.67 32.51,9.65 34.89,9.65 J2.1 39.12,13.88 39.12,21.39
  Bottom 0.254: v58.42,27.94 63.5,27.94 v71.12,35.56 78.74,35.56 92.61,21.69 92.61,9.8 93.52,8.89 94.67,8.89 95.25,9.46 95.25,10.36 96.32,11.43 102.87,11.43 XA1.VIN
+12V
  Top 0.254: U1.3 75.93,42.27 C4.1 76.85,43.18 80.01,43.18 82.55,40.64 82.55,17.02 77.36,11.82 J4.1 72.62,11.32 70.88,9.58 67.85,9.58 65.61,11.82 J3.1
CAN1_LED  (via drill 0.36)
  Top 0.254: v59.05,45.72 D4.2
  Bottom 0.254: A2.D5 40.64,39.37 52.7,39.37 v59.05,45.72
CAN2_LED  (via drill 0.36)
  Top 0.254: v59.05,43.18 D5.2
  Bottom 0.254: A2.D6 41.91,38.1 53.98,38.1 v59.05,43.18
CANH
  Top 0.254: U3.7 77.05,26.39 J10.1 77.05,16.85 74.42,14.22 71.84,14.22 J4.4
CANH1
  Top 0.254: U2.7 63.08,26.39 J6.1 60.54,21.59 49.53,21.59 48.43,20.49 R11.1 | R3.1 R4.1 R10.1 R11.1 | J3.4 48.26,20.03 R11.1
CANL
  Top 0.254: U3.6 75.56,24.34 J10.2 72.62,21.4 J4.3
CANL1
  Top 0.254: U2.6 61.59,24.34 J6.2 59.44,22.19 R4.2 | R11.2 R10.2 R4.2 | R4.2 R3.2 40.64,21.73 39.88,20.97 39.88,16.76 42.42,14.22 52.61,14.22 52.92,14.53 J3.3
CANRX1  (via drill 0.36)
  Top 0.254: v58.42,31.75 60.26,31.75 U2.4
  Bottom 0.254: A2.D23 27.79,42.06 27.79,29.03 29.29,27.53 54.2,27.53 v58.42,31.75
CANRX2  (via drill 0.36)
  Top 0.254: v72.39,31.75 74.23,31.75 U3.4
  Bottom 0.254: A2.D0 25.4,24.13 64.77,24.13 v72.39,31.75
CANTX1  (via drill 0.36)
  Top 0.254: v64.77,33.27 64.77,32.45 U2.1
  Bottom 0.254: A2.D22 27.94,46.99 62.23,46.99 64.77,44.45 v64.77,33.27
CANTX2  (via drill 0.36)
  Top 0.254: v77.72,33.02 78.11,32.64 U3.1
  Bottom 0.254: A2.D1 26.67,25.4 64.77,25.4 72.39,33.02 v77.72,33.02
GND  (via drill 0.36)
  Top 0.254: v16.51,22.86 A2.GND 16.51,43.18 A2.AGND/GND 20.91,47.58 55.88,47.58 | R9.2 R8.2 65.62,46.99 | 65.62,46.99 R7.2 | R9.2 67.78,43.18 U1.1 | C15.1 65.79,36.31 66.51,37.03 66.51,39.75 R14.2 R9.2 | C14.1 C15.1 | C15.1 64.77,35.04 64.77,34.29 62.87,32.38 U2.2 62.87,31.11 63.92,30.06 R12.1 67.73,30.06 68.58,29.21 68.58,21.59 61.11,14.12 | R13.1 77.89,30.06 76.83,31.11 U3.2 76.83,33.4 77.22,33.78 78.23,33.78 78.61,34.16 78.61,35.17 C2.1 | C2.1 C1.1 72.39,38.85 72.39,43.16 72.92,43.69 76.57,43.69 C3.2 | C2.1 77.46,36.32 C4.2 | 65.62,46.99 65.03,47.58 55.88,47.58 | C3.2 77.46,47.51 74.91,50.06 58.36,50.06 55.88,47.58 | XA1.GND 101.6,39.37 96.39,44.58 C3.2 | R2.1 18.7,20.58 17.03,20.58 v16.52,20.08 16.52,16.69 J1.4 16.28,15.52 13.97,13.21 13.97,10.16 14.73,9.4 16.76,9.4 17.78,10.41 17.78,13.46 18.29,13.97 31.58,13.97 J2.4 34.06,19.19 R6.1 | J3.2 51.84,11.86 54.1,14.12 61.11,14.12 | J4.2 67.32,14.12 61.11,14.12
  Bottom 0.254: v16.51,22.86 v16.51,20.09 v16.52,20.08
GPS_LED  (via drill 0.36)
  Top 0.152: v65.8,39.37 61.41,39.37 D1.2
  Bottom 0.152: XA1.FIX 93.98,24.13 78.74,39.37 v65.8,39.37
GPS_RX  (via drill 0.36)
  Top 0.254: A2.D7 v36.83,22.86
  Bottom 0.254: v36.83,22.86 53.34,6.35 95.25,6.35 XA1.RX
GPS_TX  (via drill 0.36)
  Top 0.254: A2.D8 39.37,23.47 v39.42,23.42
  Bottom 0.254: v39.42,23.42 55.22,7.62 93.98,7.62 XA1.TX
N$1
  Top 0.254: U2.8 64.14,27.3 65.19,28.36 R12.2
N$2
  Top 0.254: U3.8 78.11,27.3 79.16,28.36 R13.2
N$3
  Top 0.254: D3.1 R7.1
N$4
  Top 0.254: D1.1 R14.1
N$5
  Top 0.254: D4.1 R8.1
N$6
  Top 0.254: D5.1 R9.1
N$7
  Top 0.254: XA1.EN R15.1
N$8
  Top 0.254: J1.2 16.28,13.23 17.78,14.73 17.78,18.03 18.8,19.05 20.07,19.05 | 20.07,19.05 20.83,19.81 R1.2 | J1.3 19.28,18.26 20.07,19.05
N$11
  Top 0.254: R5.2 37.06,18.22 J2.3 37.06,14.82 J2.2
SENSOR_1
  Top 0.254: R1.1 R2.2 18.8,26.42 20.32,27.94 20.32,35.56 27.94,43.18 45.72,43.18 46.99,44.45 A2.D14
SENSOR_2
  Top 0.254: R6.2 R5.1 35.56,22.95 35.56,30.86 48.26,43.56 48.26,46.01 47.28,46.99 45.72,46.99 A2.D15
TEENSY_3.3V  (via drill 0.36)
  Top 0.254: v58.42,26.67 60.26,26.67 U2.5 | U3.5 70.11,30.79 64.96,30.79 v64.94,30.77
  Bottom 0.254: 55.88,26.67 27.18,26.67 25.27,28.57 25.27,42.04 A2.3.3V | 55.88,26.67 v58.42,26.67 | v64.94,30.77 63.38,29.21 58.42,29.21 55.88,26.67

### Text on the board
tPlace: 5V | IMU CAN | Vehicle CAN | GPS | HyTech Racing 2022 / Sensor Acquisition Board Front rev1 / Designed by Youssef Jaafar / Based on SAB rev4 by Bo Han Zhu | 1. F-L Suspension Linear Pot | 2. F-R Suspension Linear Pot | IMU CAN-Bus | Vehicle CAN-Bus